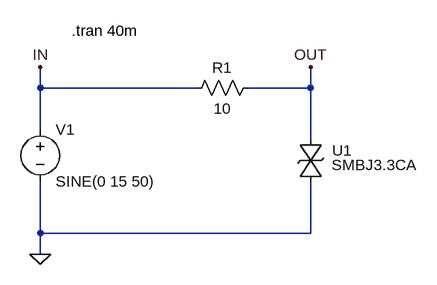
[diagram p0: schematic TVS_SMBJ3.3CA.asc]
TVS_SMBJ3.3CA.asc, the LTspice schematic file:
Version 4.1
SHEET 1 880 680
WIRE 0 112 0 80
WIRE 240 112 0 112
WIRE 416 112 416 80
WIRE 416 112 320 112
WIRE 0 176 0 112
WIRE 416 192 416 112
WIRE 0 336 0 256
WIRE 416 336 416 256
WIRE 416 336 0 336
WIRE 0 368 0 336
FLAG 0 368 0
FLAG 0 80 IN
FLAG 416 80 OUT
SYMBOL voltage 0 160 R0
WINDOW 123 0 0 Left 0
WINDOW 39 0 0 Left 0
SYMATTR InstName V1
SYMATTR Value SINE(0 15 50)
SYMBOL res 336 96 R90
WINDOW 0 0 56 VBottom 2
WINDOW 3 32 56 VTop 2
SYMATTR InstName R1
SYMATTR Value 10
SYMBOL MyLib\\Diode_TVS\\SMBJ3.3CA 400 192 R0
SYMATTR InstName U1
TEXT 48 24 Left 2 !.tran 40m

The netlist it stands for:
* TVS_SMBJ3.3CA.asc
V1 IN 0 SINE(0 15 50)
R1 OUT IN 10
X§U1 OUT 0 SMBJ3.3CA  ; pins + -
.tran 40m
.lib MyLib/Diode_TVS/SMBJ3.3.lib
.backanno
.end

* Results of the author's LTspice run, read from the files saved beside the schematic
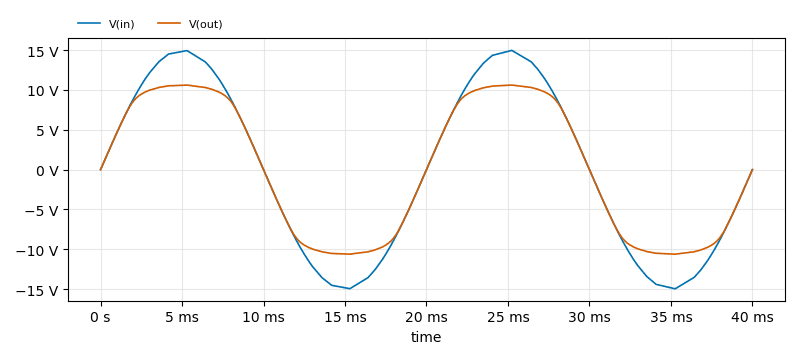
[diagram p1: Transient Analysis of TVS_SMBJ3.3CA.asc, plotted from the saved traces]
* Transient Analysis, 1 run:
*   V(in): min -14.95 V, max 14.96 V, average -779.6 µV, rms 10.55 V, last 0 V
*   V(out): min -10.61 V, max 10.61 V, average -153.6 µV, rms 8.461 V, last -189.5 µV